# EasyEDA schematic RobotController.json
TITLE: Sheet_1; REV: 1.0; Date: 2023-10-20; Sheet: 1/1; Company: Your Company

## Parts
P1  2.54mm header1*9  [HDR-9X1/2.54]
P2  2.54mm header1*9  [HDR-9X1/2.54]
R14  KSH7079_220Ω  [KSH7079_220R]
R15  KSH7079_220Ω  [KSH7079_220R]
R16  KSH7079_220Ω  [KSH7079_220R]
R17  KSH7079_220Ω  [KSH7079_220R]
R18  KSH7079_220Ω  [KSH7079_220R]
R19  KSH7079_220Ω  [KSH7079_220R]
R20  KSH7079_220Ω  [KSH7079_220R]
R21  KSH7079_220Ω  [KSH7079_220R]
U1  Migumaus Mega Shield  [ARDUINO_MEGA_R3_SHIELD_2]
U2  NRF2401  [NRF24]
U3  NO  [I2CLCD16X2_N]
U4  NO  [TOGGLE SWITCH SPDT RED 3 PIN ON-OFF-ON 3 SPDT SMALL AC 6A/125V 3A/250V]
U5  NO  [TOGGLE SWITCH SPDT RED 3 PIN ON-OFF-ON 3 SPDT SMALL AC 6A/125V 3A/250V]
U6  NO  [TOGGLE SWITCH SPDT RED 3 PIN ON-OFF-ON 3 SPDT SMALL AC 6A/125V 3A/250V]
U7  NO  [TOGGLE SWITCH SPDT RED 3 PIN ON-OFF-ON 3 SPDT SMALL AC 6A/125V 3A/250V]
U8  NO  [TOGGLE SWITCH SPDT RED 3 PIN ON-OFF-ON 3 SPDT SMALL AC 6A/125V 3A/250V]
U9  NO  [PUSHBUTTON]
U10  NO  [PUSHBUTTON]
U11  NO  [PUSHBUTTON]
U12  NO  [788BS-20X20]
U13  NO  [CAP_10-100UF]

## Library data of the parts
P1 P2 = 2.54mm header1*9: Manufacturer: WEINANS; Manufacturer Part: 1.27mmFemale header2*5; image: //image.lceda.cn/szlcsc/C59983.jpg; Contributor: LCSC; Supplier Part: C59983
R14-R21 = KSH7079_220Ω: Power: 1/4W; Tolerance: ±1%; EasyEDA: E57439; Supplier Part: E57439; Supplier: EasyEDA; Manufacturer: UniOhm; Manufacturer Part: MFR0W4F2200A50; Contributor: ksh7079
U1 = Migumaus Mega Shield: Manufacturer Part: None; Supplier Part: undefined; Contributor: spally
U2 = NRF2401: Contributor: mandarkol
U3 = I2CLCD16X2_N: Contributor: clivep259
U4-U8 = TOGGLESWITCH SPST_SWITCH-SPDT COPY: sourceId: ceKgMGAuL; Contributor: hanzfortun09
U9-U11 = PushButton wide: Contributor: Hi_world
U12 = 788BS datasheet
U13 = CAP 10-100uF: Supplier: LCSC; Manufacturer: ValuePro; Manufacturer Part: 10uF 25V 6.3*7; Supplier Part: C43325; Contributor: pyramidak

## Nets
Net-(P1-1): P1.1 U1.69(A0)
Net-(P1-2): P1.2 P1.5 P1.8 P2.2 P2.5 P2.8 U1.73(5V) U3.2(VCC)
Net-(P1-3): P1.3 P1.6 P1.9 P2.3 P2.6 P2.9 U1.72(GND) U2.GND U3.1(GND) U4.2(P) U5.2(P) U6.2(P) U7.2(P) U8.2(P) U9.1 U9.2 U10.1 U10.2 U11.1 U11.2 U13.2
Net-(P1-4): P1.4 U1.68(A1)
Net-(P1-7): P1.7 U1.67(A2)
Net-(P2-1): P2.1 U1.66(A3)
Net-(P2-4): P2.4 U1.65(A4)
Net-(P2-7): P2.7 U1.64(A5)
Net-(R14-1): R14.1 U12.10(C4)
Net-(R14-2): R14.2 U1.46
Net-(R15-1): R15.1 U12.11(C6)
Net-(R15-2): R15.2 U1.48
Net-(R16-1): R16.1 U12.13(C1)
Net-(R16-2): R16.2 U1.43
Net-(R17-1): R17.1 U12.15(C7)
Net-(R17-2): R17.2 U1.49
Net-(R18-1): R18.1 U12.16(C8)
Net-(R18-2): R18.2 U1.53
Net-(R19-1): R19.1 U1.47
Net-(R19-2): R19.2 U12.6(C5)
Net-(R20-1): R20.1 U1.44
Net-(R20-2): R20.2 U12.3(C2)
Net-(R21-1): R21.1 U1.45
Net-(R21-2): R21.2 U12.4(C3)
Net-(U1-7): U1.7 U2.CE
Net-(U1-8): U1.8 U2.CSN
Net-(U1-20): U1.20(SDA) U3.3(SDA)
Net-(U1-21): U1.21(SCL) U3.4(SCL)
Net-(U1-22): U1.22 U8.1(O)
Net-(U1-23): U1.23 U8.3(S)
Net-(U1-24): U1.24 U7.1(O)
Net-(U1-25): U1.25 U7.3(S)
Net-(U1-26): U1.26 U6.1(O)
Net-(U1-27): U1.27 U6.3(S)
Net-(U1-28): U1.28 U5.1(O)
Net-(U1-29): U1.29 U5.3(S)
Net-(U1-30): U1.30 U4.1(O)
Net-(U1-31): U1.31 U4.3(S)
Net-(U1-32): U1.32 U10.3 U10.4
Net-(U1-33): U1.33 U9.3 U9.4
Net-(U1-34): U1.34 U11.3 U11.4
Net-(U1-35): U1.35 U12.9(R1)
Net-(U1-36): U1.36 U12.14(R2)
Net-(U1-37): U1.37 U12.8(R3)
Net-(U1-38): U1.38 U12.12(R4)
Net-(U1-39): U1.39 U12.1(R5)
Net-(U1-40): U1.40 U12.7(R6)
Net-(U1-41): U1.41 U12.2(R7)
Net-(U1-42): U1.42 U12.5(R8)
Net-(U1-50): U1.50 U2.MISO
Net-(U1-51): U1.51 U2.MOSI
Net-(U1-52): U1.52 U2.SCK
Net-(U1-74): U1.74(3.3V) U2.VCC U13.1

Not connected (* = marked no-connect by the designer): U1 0(RX0) 1(TX0) 2 3 4 5 6 9 10 11 12 13 14(TX3) 15(RX3) 16(TX2) 17(RX2) 18(TX1) 19(RX1) 54(A15) 55(A14) 56(A13) 57(A12) 58(A11) 59(A10) 60(A9) 61(A8) 62(A7) 63(A6) 70(VIN) 71(GND) 75(RST) 76(GND) 77(GND) 78(GND) 79(5V) 80(5V) 81(AREF) 82(SDA1) 83(SCL1) 84(IOREF); U2 IQR(IRQ)
